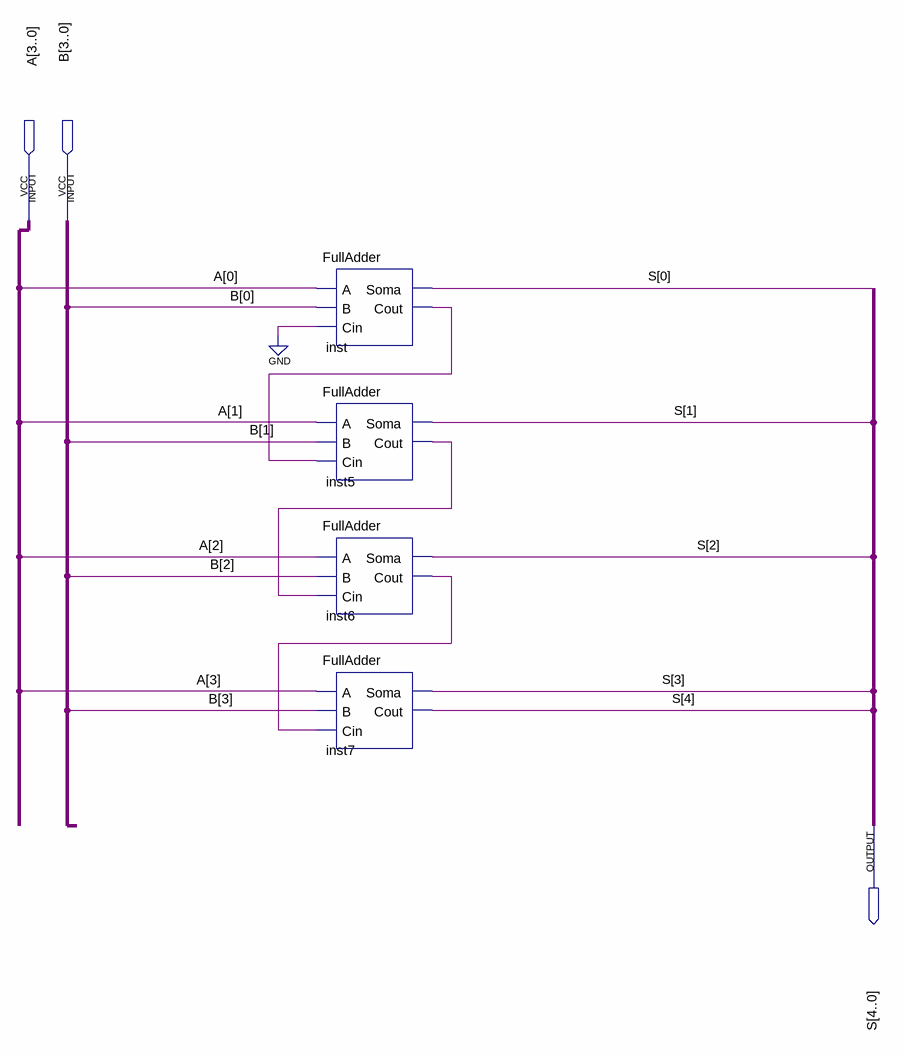
[diagram p0: schematic sheet]
// Quartus schematic Soma4bits.bdf as structural Verilog: 4 symbols, 3 pins
module Soma4bits (
  input  [3:0] A,
  input  [3:0] B,
  output [4:0] S
);

  wire inst5_cout, inst6_cout, inst_cout;

  FullAdder inst (.A(A[0]), .B(B[0]), .Cin(1'b0), .Soma(S[0]), .Cout(inst_cout));
  FullAdder inst5 (.A(A[1]), .B(B[1]), .Cin(inst_cout), .Soma(S[1]), .Cout(inst5_cout));
  FullAdder inst6 (.A(A[2]), .B(B[2]), .Cin(inst5_cout), .Soma(S[2]), .Cout(inst6_cout));
  FullAdder inst7 (.A(A[3]), .B(B[3]), .Cin(inst6_cout), .Soma(S[3]), .Cout(S[4]));
endmodule
